# Altium project Smart_Plug(Upadated01).PrjPcb
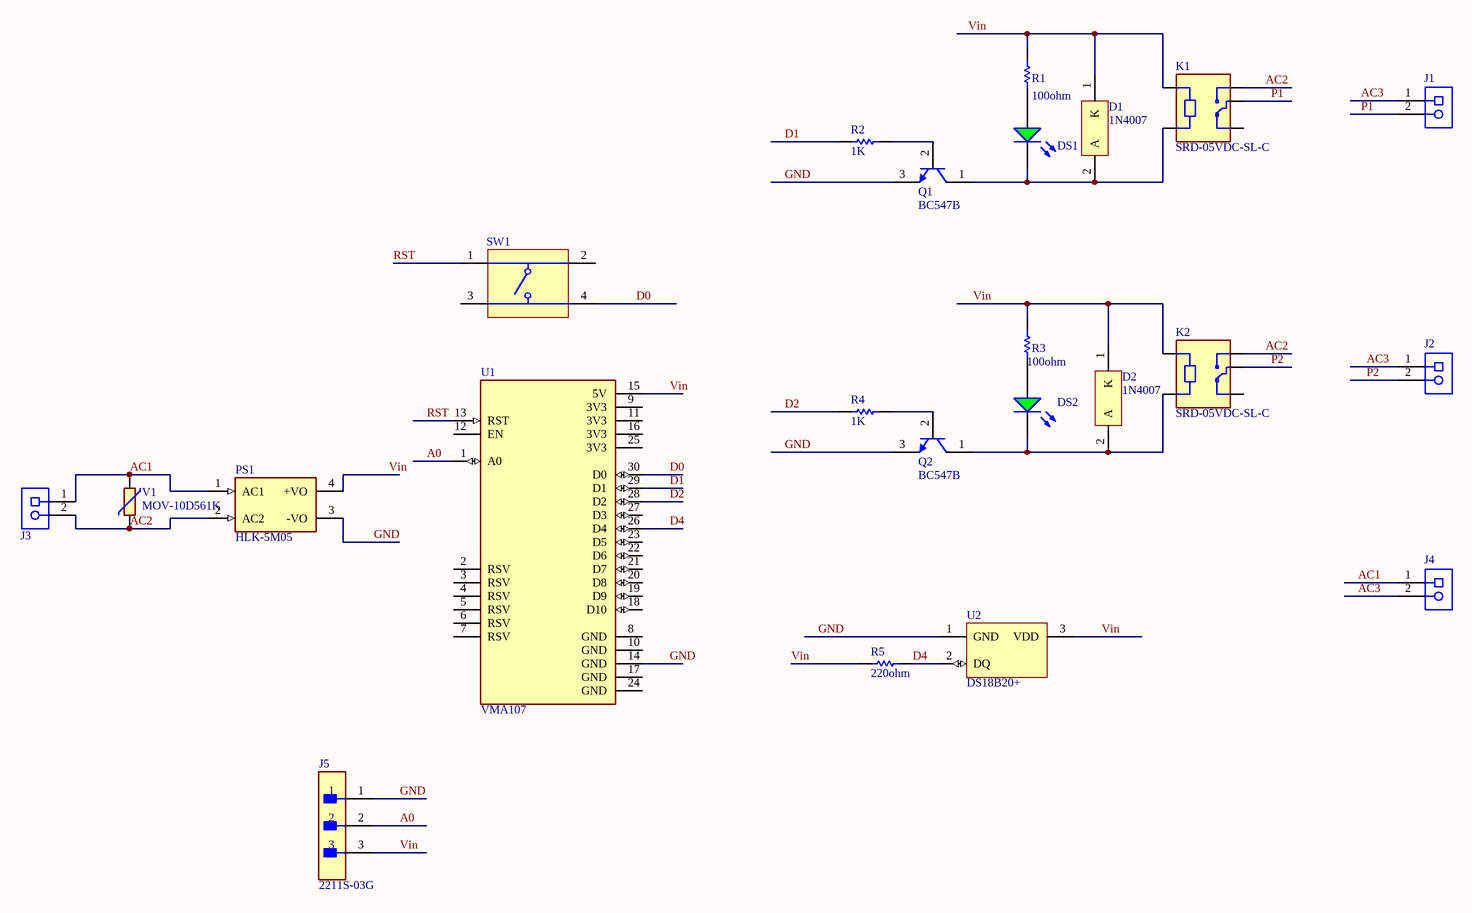
[diagram p0: Smart_Plug(Upadated01).SchDoc]
1 sheet, 23 parts. Net scope: global (net labels, ports and power ports of the same name join across sheets).
Board file: Smart_Plug(Upadated01).PcbDoc

## Sheet Smart_Plug(Upadated01).SchDoc
size B; SheetNumber: 1; SheetTotal: 1

### Parts
D1  1N4007  [ONSC-AXIAL_LEAD-2-59-10_P]
D2  1N4007  [ONSC-AXIAL_LEAD-2-59-10_P]
DS1  HLMP-3507  [AVAG-HLMP-3507]  (value not drawn)
DS2  HLMP-3507  [AVAG-HLMP-3507]  (value not drawn)
J1  1729128  [PHOE-1729128-2_V]  (value not drawn)
J2  1729128  [PHOE-1729128-2_V]  (value not drawn)
J3  1729128  [PHOE-1729128-2_V]  (value not drawn)
J4  1729128  [PHOE-1729128-2_V]  (value not drawn)
J5  2211S-03G  [FP-2211S-03G-MFG]
K1  SRD-05VDC-SL-C  [RELAY_SRD-05VDC-SL-C]
K2  SRD-05VDC-SL-C  [RELAY_SRD-05VDC-SL-C]
PS1  HLK-5M05  [CONV_HLK-5M05]
Q1  BC547B  [ONSC-TO-92-3-29-11]
Q2  BC547B  [ONSC-TO-92-3-29-11]
R1  100ohm  [RESA60-630X240]
R2  1K  [RESA60-630X240]
R3  100ohm  [RESA60-630X240]
R4  1K  [RESA60-630X240]
R5  220ohm  [RESA60-630X240]
SW1  1825910-6  [TECO-1825910-6_V]  (value not drawn)
U1  VMA107  [MODULE_VMA107]
U2  DS18B20+  [Q3+1]
V1  MOV-10D561K  [MOV-10D561]

### Nets
A0: J5.2 U1.1(A0)
AC1: J3.1 J4.1 PS1.1(AC1) V1.1
AC2: J3.2 K1.NO K2.NO PS1.2(AC2) V1.2
AC3: J1.1 J2.1 J4.2
D0: SW1.4 U1.30(D0)
D1: R2.1 U1.29(D1)
D2: R4.1 U1.28(D2)
D4: R5.2 U1.26(D4) U2.2(DQ)
GND: J5.1 PS1.3(-VO) Q1.3(E) Q2.3(E) U1.14(GND) U2.1(GND)
P1: J1.2 K1.COM
P2: J2.2 K2.COM
RST: SW1.1 U1.13(RST)
Vin: D1.1(K) D2.1(K) J5.3 K1.A1 K2.A1 PS1.4(+VO) R1.1 R3.1 R5.1 U1.15(5V) U2.3(VDD)
NetD1_2: D1.2(A) DS1.2(K) K1.A2 Q1.1(C)
NetD2_2: D2.2(A) DS2.2(K) K2.A2 Q2.1(C)
NetDS1_1: DS1.1(A) R1.2
NetDS2_1: DS2.1(A) R3.2
NetQ1_2: Q1.2(B) R2.2
NetQ2_2: Q2.2(B) R4.2

Not connected (* = marked no-connect by the designer): K1 NC; K2 NC; SW1 2 3; U1 2(RSV) 3(RSV) 4(RSV) 5(RSV) 6(RSV) 7(RSV) 8(GND) 9(3V3) 10(GND) 11(3V3) 12(EN) 16(3V3) 17(GND) 18(D10) 19(D9) 20(D8) 21(D7) 22(D6) 23(D5) 24(GND) 25(3V3) 27(D3)

### Library data of the parts
D1 D2 = CMP-0902-00142-1: Standard Recovery Rectifier, 2-Pin Axial_Lead, Pb-Free, Bulk Bag; Manufacturer: On Semiconductor; IO(rec) Max (A): 1; IFSM Max (A): 30; VRRM Max (V): 1000; ComponentLink3URL: http://www.onsemi.cn/pub_link/Collateral/59-10.PDF; PackageVersion: Rev. U, 02/2005; PackageDescription: 2-Pin, Axial Lead, Diameter 2.35 mm; PackageReference: AXIAL_LEAD-2-59-10; RoHS: TRUE; PartNumber: 1N4007; Packing: Bulk Bag; DatasheetVersion: Rev. 13; ComponentLink3Description: Package Specification; ComponentLink1Description: Manufacturer URL; ComponentLink2URL: http://www.onsemi.com/pub_link/Collateral/1N4001-D.PDF; ComponentLink1URL: http://www.onsemi.com/; Type: Standard Recovery; ComponentLink2Description: Datasheet; Mounting Technology: Through Hole
DS1 DS2 = CMP-2000-06412-1: T-1 3/4 (5 mm) Diffused LED Lamp, Green, 2.1 V, -20 to 100 degC, 2-Pin THD, RoHS, Bulk; Manufacturer: Avago; Type: Uni-Color; Reverse Voltage: 5V; Product Depth (mm): 6.1mm; Lum Intensity: 4.2mcd; Chip Material: GaP; Emitting Color: YellowGreen; Number of  Elements: 1; Forward Voltage: 2.7V; Dominant Wave Length: 569nm; Peak Wavelength: 565nm; Rad Hardened: No; Shape Type: Circular; Forward Current: 25mA; Product Height (mm): 9.19mm; Power Dissipation: 85W; Viewing Angle: 60deg; Main Category: StandardLED; Lens Type: ColoredDiffused; Test Current (It): 10mA; DELETED: Compliant; Package Description: 2-Pin Through Hole Device, Dia 5.845 mm, Pitch 2.54 mm; Datasheet URL: http://docs.avagotech.com/docs/AV02-1558EN; Operating Temperature Classification: Industrial; Pin Count: 2; Datasheet Version: 03/2015; Operating Temp Range: -40Cto100C; Package Reference: HLMP-3507; Mounting: ThroughHole; Mounting Technology: ThroughHole; Manufacturer URL: http://www.avagotech.com/; High Brightness: No; Luminous Intensity: 4.2mcd; Package Type: T-13/4; Product Length (mm): 6.1mm; Lens Dimensions: 5.08x5.08x8.3mm
J1-J4 = CMP-2000-05815-1: PCB Terminal Block, 13.5 A, 400 V, 2-Pin THD, RoHS, Bulk; Manufacturer: Phoenix Contact; Package Version: 03/2015; No. of Rows: 1; Pitch: 5.08mm; No. of Positions: 2; Voltage Rating: 400V; Current Rating: 13500mA; Manufacturer URL: http://www.phoenixcontact.com/; Datasheet URL: https://datasheet.ciiva.com/16046/1729128-16046181.pdf; RoHS: TRUE; Package URL: https://www.phoenixcontact.com/online/portal/pi/pxc/product_detail_page/!ut/p/b1/3VdJjqNKFDxLH8AFycySyWY2ozFsEPOMMQaDOX1XedGL_1Vdm5YXJleknhSKeBkvI6EA8ncAo3AYoDhBQGco6KN7VURTdemj9us_IEKEZo_YHiPAEWEFmDGOHMORkqKYCORBZxgL7ZoaZYcbFFUZ3fqxSY6GOuxydWUuHqz1ynmMFygu583Bob0Ewr6Sd_l-5m-kAueHiB0jpRwZwe58wwtkpxtMYd_LmGcDRU02dRNEyWt6Y2ti5pSyJ_reIkzIulrqApdnbT11V5jnCKbYNCvhEM1MCpPByat_X379-iThf08CI5GfOPqfBeS3BRoBOdD55AKVv0iLwCMq-2BrzXWSGRH7pUGD9uwXQjiph3xL0DKQwdGa0JImiIOmBNOestqgwTHSSs2oOep-78apyXQBvNi8ZLaFjvjWvcaUEBu0MC6Wbe-d6mB0FAebo2lUWinqYaZs5DAYzV0RP9yitUjnGJ0iI9xhZkT42OCQNUJJhkgWINNQLP2JFP6OpMg3JCVg70jqHT0lvKOnhHf0lPuOnnLf0VPuWx6_dxwUIvwk5WMkT0kLL1mh61l2yZVSzG3pYV_bqo-mj6uMKwKwdnnW8Jh5RTOJzMOA5c-eJDaZQw4mTMPH02PvS_ZAqNVjVTo2WyYLkwH_KU1mmmG5kjRhDqPXLwwVHvVOjCM60-fpXvTDfMGW1PVFVS1r4e4yVDk4ZdNbkUHvqPqQSeian4UD39fNKmachqdJ1NJbyk8rXT9mXTvPk3oE5meulKGgiruPJek-4I9hTT6G8ZLOyRSm2RRVbThERQad5OS28hdt4YW4vG0stgYYzsWsK4_7y6DZMjJSCqri1kyiZR5vD7pwIrNR7QwPHTcLTI5qT7eRlpHrdGiupYlqQDJ7zy_CND8fWWBoLRXxk1RVcXiBQwbTD4Xi7KL-FuO94t9xaqweXzH; PartNumber: 1729128; Package Description: 2-Pin Through Hole Device, Body 8.1 x 10.16 mm, Pitch 5.08 mm; Datasheet Version: 12/2013; Mounting Technology: ThroughHole; Orientation: Horizontal; Package Reference: 1729128-2; Packing: Bulk
J5 = CMP-12414-000004-1: Board-To-Board Connector, Vertical, 2.54 mm, 3 Contacts, Header, 2211S Series, Through Hole, 1 Rows; Number of Contacts: 3; Insulation Resistance: 1GR; Gender: Male; REACH SVHC: No SVHC; Termination: Through Hole; Flammability Rating: UL94 V-0; Contact Material: Copper Alloy; Width: 0.12inch; Weight: 0.11lb; Contact Plating: Gold; Mount: Through Hole; Number of Rows: 1; Height: 0.47inch; Length: 0.31inch
K1 K2 = SRD-05VDC-SL-C: 5V Trigger Relay Module For Arduino And Raspberry Pi 5V Trigger Relay Module For Arduino And Raspberry Pi; MF: Songle Relay; SnapEDA_Link: https://www.snapeda.com/parts/SRD-05VDC-SL-C/Songle+Relay/view-part/?ref=snap; MP: SRD-05VDC-SL-C; Availability: Not in stock; Package: NON STANDARD-5 Songle Relay; Value: *; Price: None; Check_prices: https://www.snapeda.com/parts/SRD-05VDC-SL-C/Songle+Relay/view-part/?ref=eda
PS1 = HLK-5M05: AC DC 220V to 5V 5W 5Watt Isolated Switching Step-Down Power Supply Module Converter; MF: Hi-link; SnapEDA_Link: https://www.snapeda.com/parts/HLK-5M05/Hi-link/view-part/?ref=snap; Check_prices: https://www.snapeda.com/parts/HLK-5M05/Hi-link/view-part/?ref=eda; Value: *; Availability: Not in stock; Price: None; MP: HLK-5M05; Package: Package
Q1 Q2 = CMP-1048-01467-1: Amplifier Transistor, NPN Silicon, 3-Pin TO-92, Bulk Box; Manufacturer: On Semiconductor; IC Continuous (A): 0.1; fT Min (MHz): 150; DatasheetVersion: Rev. 7; ComponentLink1URL: http://www.onsemi.com/; Polarity: NPN; RoHS: FALSE; ComponentLink1Description: Manufacturer URL; Packing: Bulk Box; PackageDescription: 3-Pin Transistor Outline, Body 4.825 x 3.685 mm, Pitch 1.27 mm; ComponentLink3URL: http://www.onsemi.cn/pub_link/Collateral/2N6426-D.PDF; ComponentLink2Description: Datasheet; PackageVersion: Rev. AM; PackageReference: TO-92-3-29-11_AM_SL; ComponentLink3Description: Package Specification; Mounting Technology: Through Hole; PartNumber: BC547B; ComponentLink2URL: http://www.onsemi.com/pub_link/Collateral/BC546-D.PDF
R1-R5 = CMP-1659-00073-1: Axial Resistor, 100 KOhm, +/- 1%, 0.25 W, -55 to 155 degC, 2-Pin THD, RoHS, Bulk; Voltage Rating: 250 V; Power Rating: 250 mW; Resistance: 475 Ohm; PackageDescription: 2-Pin Axial Lead, Dia 2.4 mm, Body Length 6.3 mm; PackageReference: MFR-25; Length: 0.248 inch; ComponentLink2Description: Datasheet; Packaging: Bulk; DatasheetVersion: Apr-13; Package Quantity: 200; Min Operating Temperature: -55 degC; ComponentLink2URL: http://www.yageo.com/documents/recent/Yageo%20LR_MFR_2013.pdf; RoHSCompliant: true; ComponentLink1URL: http://www.yageo.com/; Tolerance: 1%; Case\Package: Axial; Mount: Through Hole; ComponentLink1Description: Manufacturer URL; Max Operating Temperature: 155 degC
SW1 = CMP-1684-00021-1: Tact Switch, SPST-NO, 0.05 A, -35 to 85 degC, 4-Pin THD, RoHS, Bulk; Manufacturer: TE Connectivity; Maximum Contact Resistance: 100mOhm; Mechanical Life: 100000Cycles; Bushing Type: Unthreaded; Switch Configuration: OFF(ON); Maximum DC Voltage Rating: 24V; Contact Rating @ Voltage: 0.05A@24VDC; Actuator Color: Black; Body Orientation: Straight; Function: MomentaryContact; Illumination: N/R; Actuator Style: RoundButton; Actuator Material: PolybutyleneTerephthalate; Dielectric Strength: 500VAC; Pole Throw Configuration: SPST; Actuator Length: 1.4mm; Product Weight: N/A; Contact Material: CopperAlloy; Housing Material: N/A; Terminal Type: PCPins; Minimum Insulation Resistance: 100MOhm; Package Description: 4-Pin Through Hole Device, Body 5.99 x 5.99 mm, Pitch 6.5 mm; Part No: 1825910-6; Package Reference: THD; Base Material: N/A; Manufacturer URL: http://www.te.com; Contact Plating: Silver; RoHS: Yes; Datasheet Version: Rev. C9; Electrical Life: 100000Cycles; Maximum AC Voltage Rating: N/A; Thread Size: N/R; Operating Temperature: -35to85C; Mounting: ThroughHole; Dimension: 5.99x5mm; Datasheet URL: http://www.te.com/commerce/DocumentDelivery/DDEController?Action=showdoc&DocId=Customer+Drawing%7F1825910%7FC9%7Fpdf%7FEnglish%7FENG_CD_1825910_C9.pdf%7F1825910-6; Family: 1825910; Seal Location: N/A; Seal Description: N/A; Packaging: N/A
U1 = VMA107: NodeMCU V2 Lua Based ESP8266 Development Board; MF: Velleman; MP: VMA107; Availability: Not in stock; Price: None; Check_prices: https://www.snapeda.com/parts/VMA107/Velleman/view-part/?ref=eda; Value: *; SnapEDA_Link: https://www.snapeda.com/parts/VMA107/Velleman/view-part/?ref=snap; Package: None
U2 = CMP-0253-00003-1: Programmable Resolution Digital Thermometer, 1-Wire Interface, ±0.5°C Accuracy, 3-Pin TO92, -55°C to +125°C, Pb-Free; ComponentLink2URL: http://datasheets.maxim-ic.com/en/ds/DS18B20.pdf; PackageReference: Q3+1; ComponentLink1Description: Manufacturer URL; PackageDescription: TO-92 Package, Body Dia. 4.7mm; Leads 0.51 x 0.51 mm (max), Pb-Free; DatasheetVersion: 2007; Code_JEDEC: TO-226-AA; ComponentLink1URL: http://www.maxim-ic.com; PackageVersion: revB, 2009; ComponentLink2Description: Datasheet
V1 = MOV-10D561K: 560 V 2.5 kA Varistor 1 Circuit Through Hole Disc 10mm; MF: Bourns; SnapEDA_Link: https://www.snapeda.com/parts/MOV-10D561K/Bourns/view-part/?ref=snap; Price: None; Availability: In Stock; Package: Disc-10 Bourns; MP: MOV-10D561K; Value: *; Check_prices: https://www.snapeda.com/parts/MOV-10D561K/Bourns/view-part/?ref=eda; Purchase-URL: https://pricing.snapeda.com/search/part/MOV-10D561K/?ref=eda